# Altium project B100.PrjPcb (part 1 of 7)
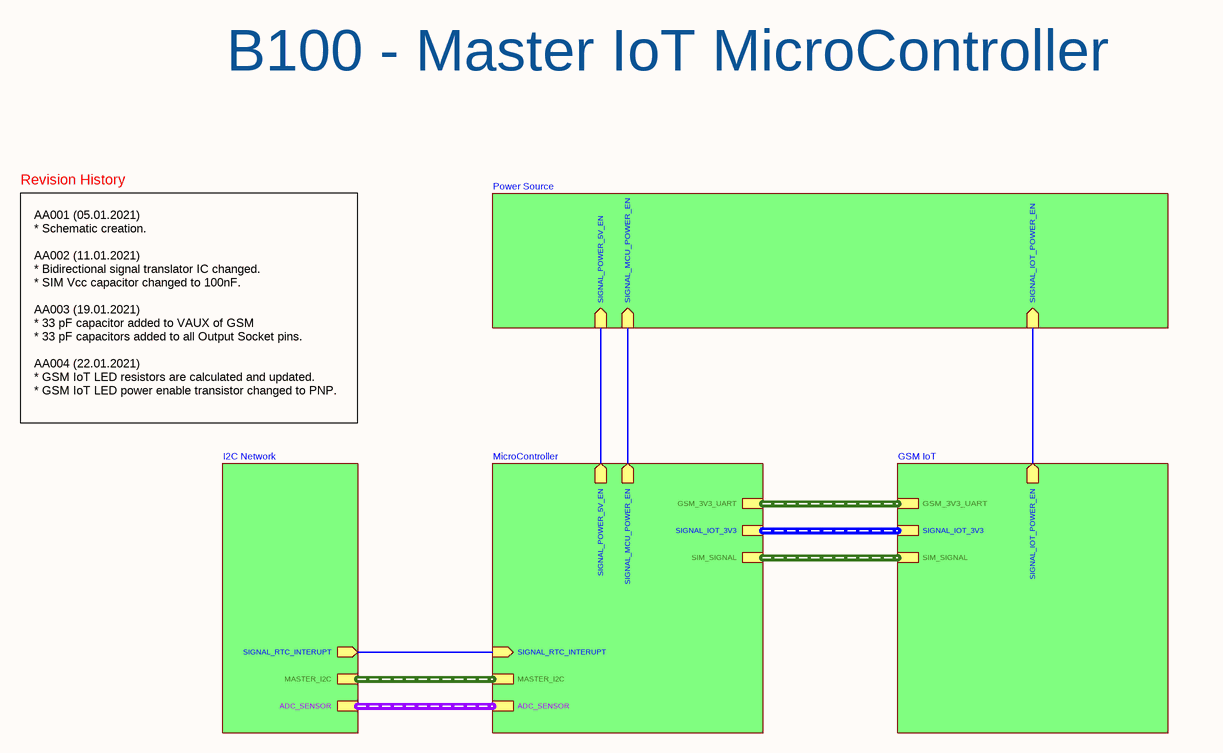
[diagram p0: B100 Block Diagram.SchDoc]
Address1_: Necip Fazıl Mah. Ortaırmak Sok.; Address2_: Birgül Apt. No: 19/6; Address3_: Meram / Konya; Address4_: Turkiye; Customer_: -; Engineer_: Mehmet Günce Akkoyun; Git_Repo_Address_: https://www.github.com/akkoyun/B100; link_: http://www.ovoo.me; Module_ID_: B100; Organization_: Ovoo Electronics; Phone_: +90 506 7444300; Product_Desc_: GSM Iot Based Plug&Play SOM; Product_ID_: -; Revision_: R06; Title_: Power Source Segment Block Diagram; Version_: AA
54 sheets, 361 parts. Net scope: hierarchical (ports join the sheet entries above them; power ports are global).
Board file: B100AA PCB R1.PcbDoc
Sheets:
  B100 Block Diagram.SchDoc
    Power Source = Power Source.SchDoc
      3V8 Buck Boost Converter = 3V8 Buck Boost Converter.SchDoc
      5V Buck Boost Converter = 5V Buck Boost Converter.SchDoc
      GSM Power Switch & Filter = GSM Power.SchDoc
      Main Power Switch = Main Power Switch.SchDoc
      3V3 LDO Regulator = 3V3 LDO Regulator.SchDoc
    GSM IoT = GSM IoT.SchDoc
      GE910QUAD Modem = GE910QUAD Modem.SchDoc
      Signal Control = GSM Signal Control.SchDoc
      Voltage Translator = Bidirectional Voltage Translator.SchDoc
      LED Indicators = GSM LED Indicators.SchDoc
    MicroController = MicroController.SchDoc
      Master MicroController = Master MicroController.SchDoc
        Master MicroController Core = Master MicroController Core.SchDoc
        PORT A = Master MicroController Port A.SchDoc
        PORT B = Master MicroController Port B.SchDoc
        PORT C = Master MicroController Port C.SchDoc
        PORT E = Master MicroController Port E.SchDoc
        PORT F = Master MicroController Port F.SchDoc
        PORT G = Master MicroController Port G.SchDoc
        PORT H = Master MicroController Port H.SchDoc
        PORT K = Master MicroController Port K.SchDoc
        PORT L = Master MicroController Port L.SchDoc
        PORT J = Master MicroController Port J.SchDoc
        PORT D = Master MicroController Port D.SchDoc
        Serial Communication = Master MicroController Serial Communication Port.SchDoc
      PORT Outputs = Module Output Sockets.SchDoc
        PORT K Filter Capacitors = Filter Capacitors - Port K.SchDoc
        Master ICSP Filter Capacitors = Filter Capacitors - Master ICSP.SchDoc
        PORT C Filter Capacitors = Filter Capacitors - Port C.SchDoc
        PORT L Filter Capacitors = Filter Capacitors - Port L.SchDoc
        FOTA ICSP Filter Capacitors = Filter Capacitors - FOTA ICSP.SchDoc
        SIM Signal Filter Capacitors = Filter Capacitors - External SIM.SchDoc
        Signal IoT Filter Capacitors = Filter Capacitors - Signal IoT.SchDoc
        PORT A Filter Capacitors = Filter Capacitors - Port A.SchDoc
        FOTA Digital ICSP Filter Capacitors = Filter Capacitors - FOTA Digital ICSP.SchDoc
        IoT UART Filter Capacitors = Filter Capacitors - IoT UART.SchDoc
        PORT F Filter Capacitors = Filter Capacitors - Port F.SchDoc
        Serial Communication Filter Capacitors = Filter Capacitors - Serial Communication.SchDoc
        ADC Sensor Filter Capacitors = Filter Capacitors - ADC Sensor.SchDoc
        I2C Filter Capacitors = Filter Capacitors - I2C.SchDoc
      FOTA MicroController Power Trigger = FOTA MicroController Power Switch.SchDoc
      SD Card and Select Switch = SD Card.SchDoc
      FOTA Burn Buffer = ICSP Burn Buffer.SchDoc
      FOTA MicroController = FOTA MicroController.SchDoc
      Buzzer = Buzzer.SchDoc
      LED Inducators = Master MicroController LED.SchDoc
    I2C Network = I2C Network.SchDoc
      I2C Multiplexer = I2C Multiplexer.SchDoc
      I2C Real Time Clock = Real Time Clock.SchDoc
      I2C Serial ID EEprom = Serial ID EEPROM.SchDoc
      I2C EEprom = EEPROM.SchDoc
      I2C Analog Digital Converter = Analog Digital Converter.SchDoc

## Sheet B100 Block Diagram.SchDoc: B100 Block Diagram
size A4; ApprovedBy: Mehmet Günce Akkoyun; CheckedBy: Mehmet Günce Akkoyun; Author: Mehmet Günce Akkoyun; CompanyName: Ovoo Electronics; DrawnBy: Mehmet Günce Akkoyun; Engineer: Mehmet Günce Akkoyun; Organization: Ovoo Electronics; Address1: Necip Fazıl Mah. Ortaırmak Sok.; Address2: Birgül Apt. No: 19/6; Address3: Meram / Konya; Address4: Turkiye; DocumentNumber: 1; Revision: R06; SheetNumber: 1; SheetTotal: 54

### Sub-sheets
GSM IoT = GSM IoT.SchDoc: GSM_3V3_UART (harness GSM_3V3_UART), SIGNAL_IOT_3V3 (harness SIGNAL_IOT_3V3), SIGNAL_IOT_POWER_EN (out), SIM_SIGNAL (harness SIM_SIGNAL)
I2C Network = I2C Network.SchDoc: MASTER_I2C (harness MASTER_I2C), SIGNAL_RTC_INTERUPT (out), ADC_SENSOR (harness ADC_SENSOR)
MicroController = MicroController.SchDoc: GSM_3V3_UART (harness GSM_3V3_UART), SIGNAL_IOT_3V3 (harness SIGNAL_IOT_3V3), SIM_SIGNAL (harness SIM_SIGNAL), SIGNAL_MCU_POWER_EN (out), SIGNAL_POWER_5V_EN (out), MASTER_I2C (harness MASTER_I2C), SIGNAL_RTC_INTERUPT (in), ADC_SENSOR (harness ADC_SENSOR)
Power Source = Power Source.SchDoc: SIGNAL_MCU_POWER_EN (in), SIGNAL_IOT_POWER_EN (in), SIGNAL_POWER_5V_EN (in)

### Nets
SIGNAL_IOT_3V3.SIGNAL_IOT_POWER_EN: sheet Power Source/SIGNAL_IOT_POWER_EN, sheet GSM IoT/SIGNAL_IOT_POWER_EN
SIGNAL_MCU_POWER_EN: sheet Power Source/SIGNAL_MCU_POWER_EN, sheet MicroController/SIGNAL_MCU_POWER_EN
SIGNAL_POWER_5V_EN: sheet Power Source/SIGNAL_POWER_5V_EN, sheet MicroController/SIGNAL_POWER_5V_EN
SIGNAL_RTC_INTERUPT: sheet MicroController/SIGNAL_RTC_INTERUPT, sheet I2C Network/SIGNAL_RTC_INTERUPT

### Buses and harness runs
harness sheet GSM IoT/GSM_3V3_UART = sheet MicroController/GSM_3V3_UART
harness sheet GSM IoT/SIGNAL_IOT_3V3 = sheet MicroController/SIGNAL_IOT_3V3
harness sheet GSM IoT/SIM_SIGNAL = sheet MicroController/SIM_SIGNAL
harness sheet I2C Network/ADC_SENSOR = sheet MicroController/ADC_SENSOR
harness sheet I2C Network/MASTER_I2C = sheet MicroController/MASTER_I2C

### Notes on the sheet
- B100 - Master IoT MicroController
- Revision History
- AA001 (05.01.2021)
  * Schematic creation.
  AA002 (11.01.2021)
  * Bidirectional signal translator IC changed.
  * SIM Vcc capacitor changed to 100nF.
  AA003 (19.01.2021)
  * 33 pF capacitor added to VAUX of GSM
  * 33 pF capacitors added to all Output Socket pins.
  AA004 (22.01.2021)
  * GSM IoT LED resistors are calculated and updated.
  * GSM IoT LED power enable transistor changed to PNP.
- Engineer
- All Rights are reserved to Customer and Engineer. [2021]
- Size:
- Date:
- A4
- Project :
- Time:
- Sheet
- of
- Customer
- Product ID
- Module ID
- Version
- File:
- Revision

## Sheet Power Source.SchDoc: Power Architechture Block Diagram
size A3; ApprovedBy: Mehmet Günce Akkoyun; CheckedBy: Mehmet Günce Akkoyun; Author: Mehmet Günce Akkoyun; CompanyName: Ovoo Electronics; DrawnBy: Mehmet Günce Akkoyun; Engineer: Mehmet Günce Akkoyun; Organization: Ovoo Electronics; Address1: Necip Fazıl Mah. Ortaırmak Sok.; Address2: Birgül Apt. No: 19/6; Address3: Meram / Konya; Address4: Turkiye; DocumentNumber: 2; Revision: R06; SheetNumber: 2; SheetTotal: 54
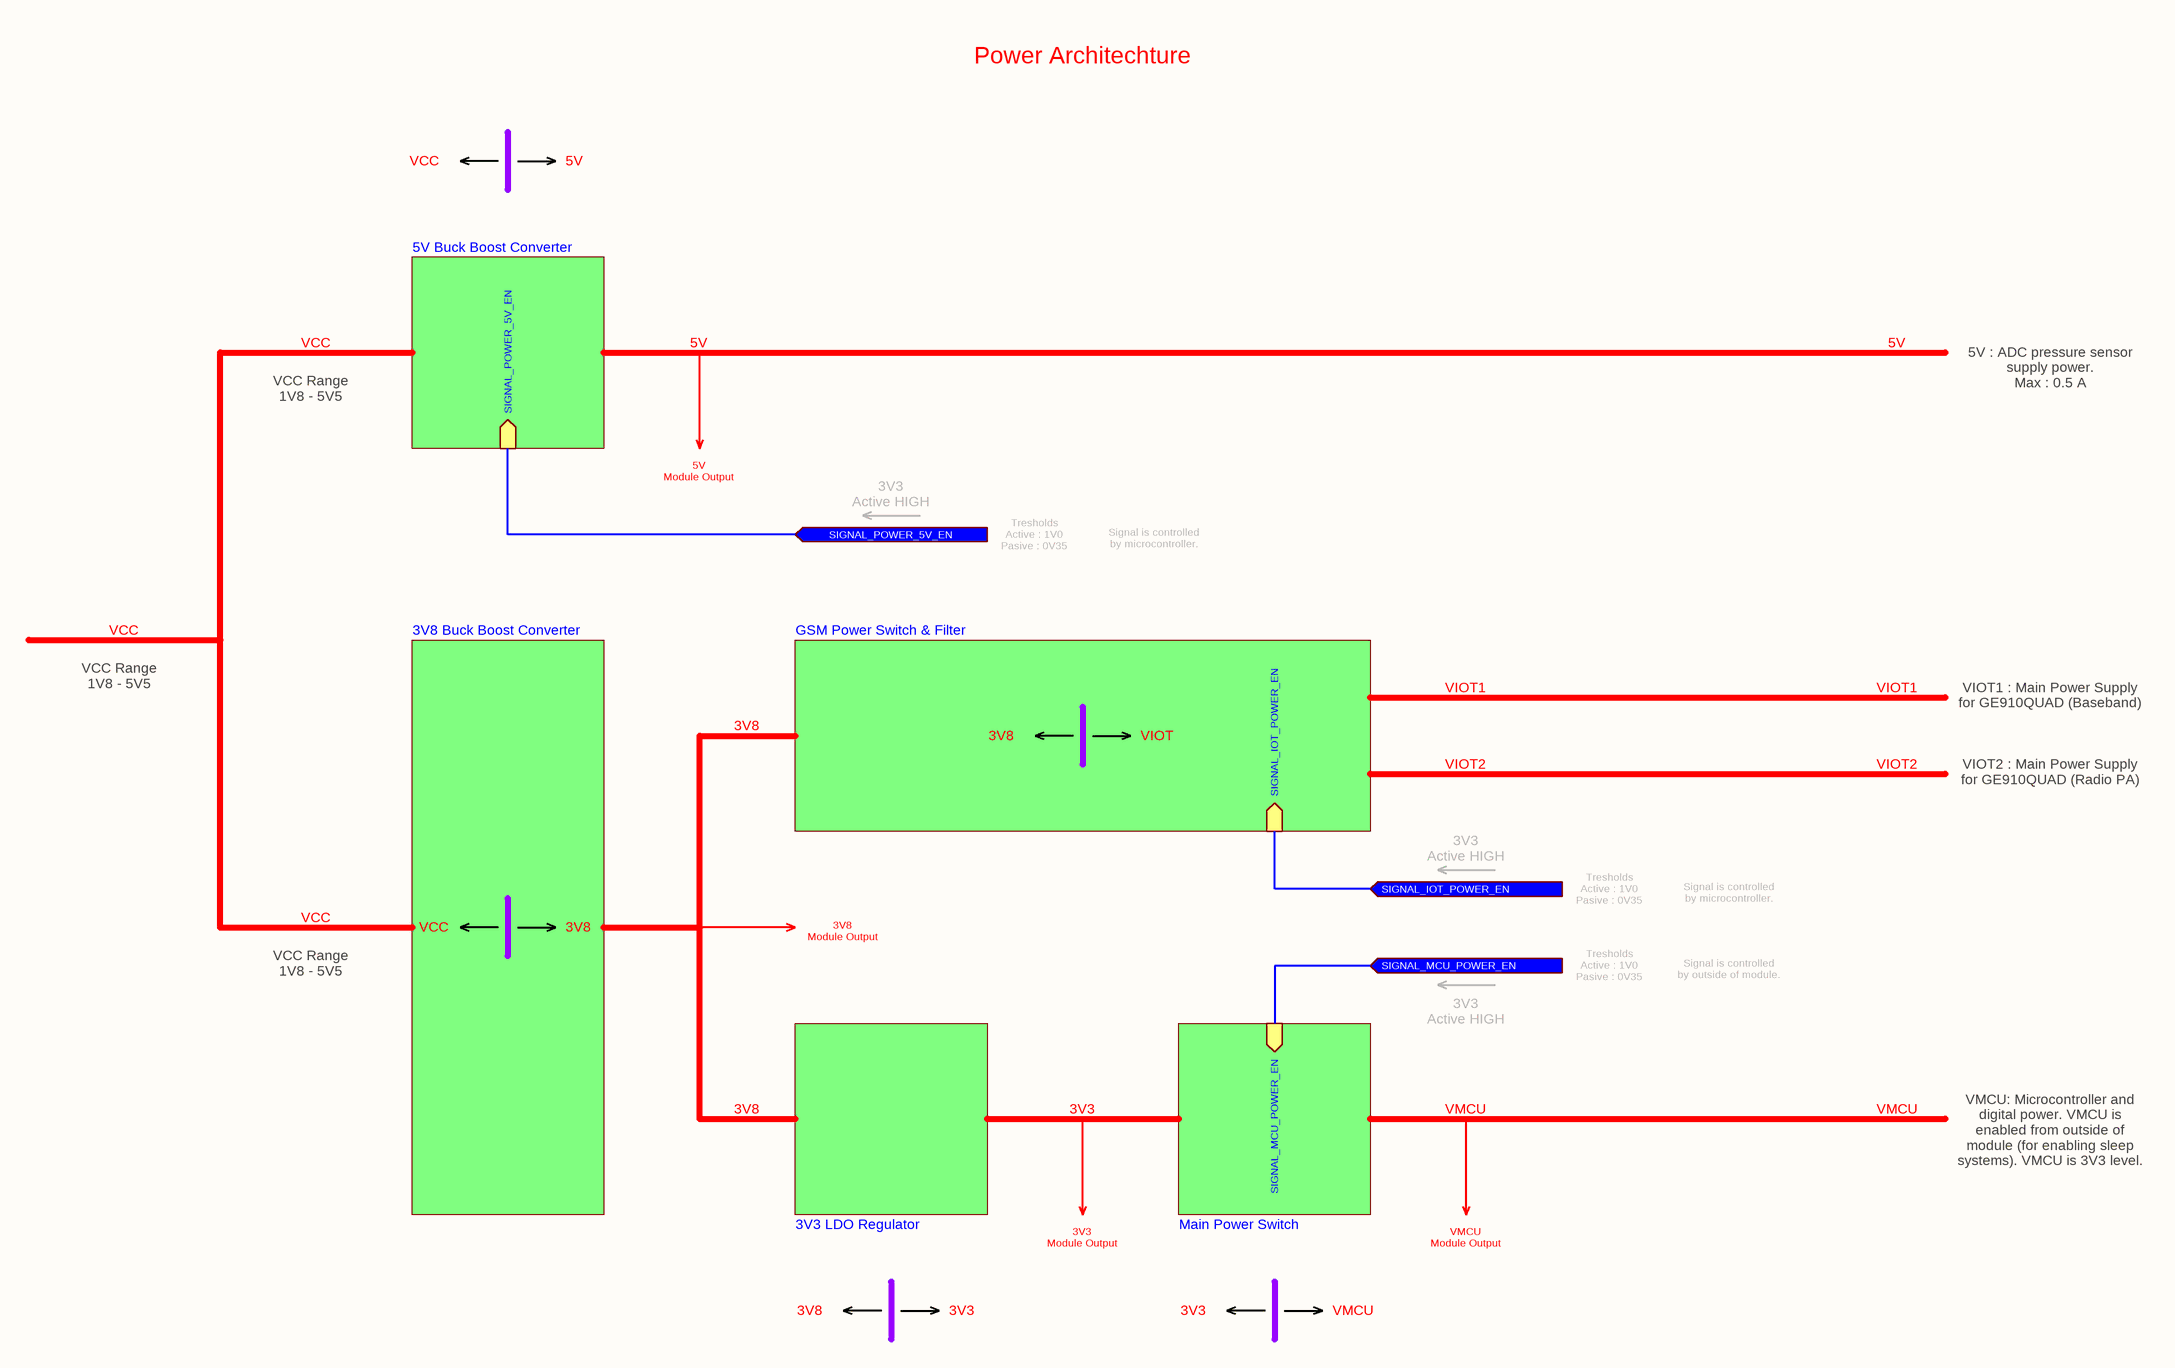
[diagram p1: Power Source.SchDoc]

### Sub-sheets
3V3 LDO Regulator = 3V3 LDO Regulator.SchDoc: no entries
3V8 Buck Boost Converter = 3V8 Buck Boost Converter.SchDoc: no entries
5V Buck Boost Converter = 5V Buck Boost Converter.SchDoc: SIGNAL_POWER_5V_EN (in)
GSM Power Switch & Filter = GSM Power.SchDoc: SIGNAL_IOT_POWER_EN (in)
Main Power Switch = Main Power Switch.SchDoc: SIGNAL_MCU_POWER_EN (in)

### Ports
SIGNAL_IOT_POWER_EN (in), SIGNAL_MCU_POWER_EN (in), SIGNAL_POWER_5V_EN (in)

### Nets
SIGNAL_IOT_3V3.SIGNAL_IOT_POWER_EN: port SIGNAL_IOT_POWER_EN, sheet GSM Power Switch & Filter/SIGNAL_IOT_POWER_EN
SIGNAL_MCU_POWER_EN: port SIGNAL_MCU_POWER_EN, sheet Main Power Switch/SIGNAL_MCU_POWER_EN
SIGNAL_POWER_5V_EN: port SIGNAL_POWER_5V_EN, sheet 5V Buck Boost Converter/SIGNAL_POWER_5V_EN

### Notes on the sheet
- Power Architechture
- VCC
- 5V
- VCC Range
  1V8 - 5V5
- 5V
  Module Output
- 5V : ADC pressure sensor supply power.
  Max : 0.5 A
- 3V3
  Active HIGH
- Tresholds
  Active : 1V0
  Pasive : 0V35
- Signal is controlled by microcontroller.
- 3V8
- VIOT
- VIOT2
- VIOT1
- VIOT1 : Main Power Supply for GE910QUAD (Baseband)
- VIOT2 : Main Power Supply for GE910QUAD (Radio PA)
- 3V8
  Module Output
- Signal is controlled by outside of module.
- 3V3
- VMCU
- 3V3
  Module Output
- VMCU
  Module Output
- VMCU: Microcontroller and digital power. VMCU is enabled from outside of module (for enabling sleep systems). VMCU is 3V3 level.
- Title
- Size:
- Date:
- A3
- Number:
- Time:
- Revision:
- Sheet
- of
- File:

## Sheet 3V8 Buck Boost Converter.SchDoc: 3V8 DC/DC Buck Boost Converter
size A4; ApprovedBy: Mehmet Günce Akkoyun; CheckedBy: Mehmet Günce Akkoyun; Author: Mehmet Günce Akkoyun; CompanyName: Ovoo Electronics; DrawnBy: Mehmet Günce Akkoyun; Engineer: Mehmet Günce Akkoyun; Organization: Ovoo Electronics; Address1: Necip Fazıl Mah. Ortaırmak Sok.; Address2: Birgül Apt. No: 19/6; Address3: Meram / Konya; Address4: Turkiye; DocumentNumber: 3; Revision: R06; SheetNumber: 3; SheetTotal: 54
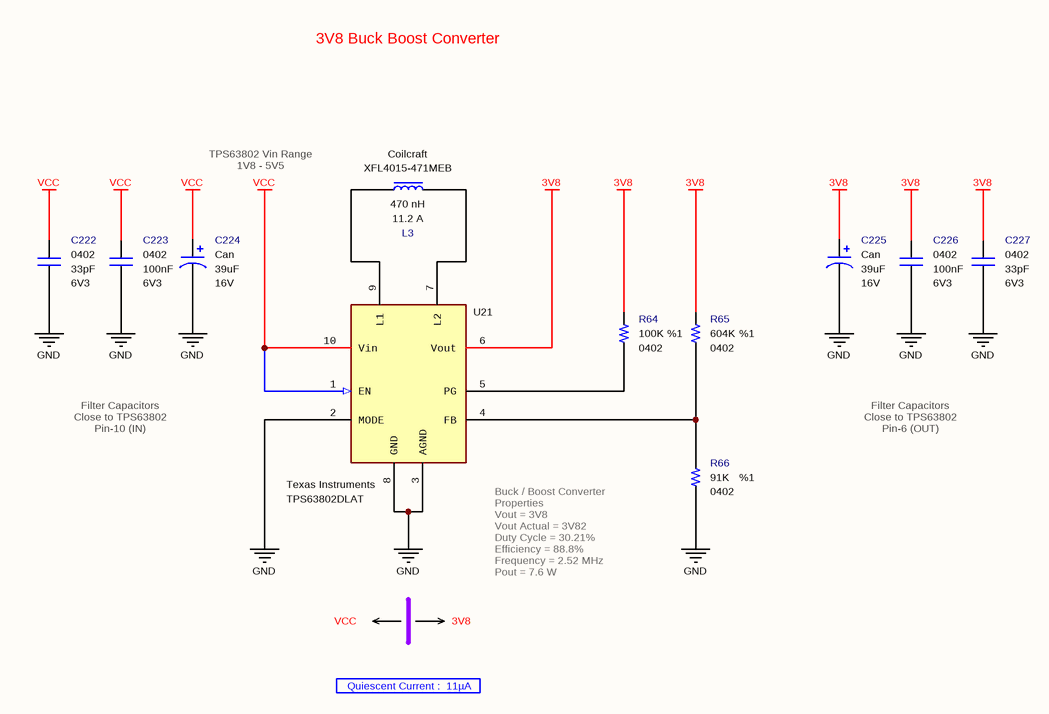
[diagram p2: 3V8 Buck Boost Converter.SchDoc]

### Parts
C222  value 33pF  Case: 0402  Voltage: 6V3  [CAPACITOR_0402]  (hidden comment: Multilayer Ceramic Capacitor)
C223  value 100nF  Case: 0402  Voltage: 6V3  [CAPACITOR_0402]  (hidden comment: Multilayer Ceramic Capacitor)
C224  value 39uF  Case: Can  Voltage: 16V  [CAPACITOR_CAN-B6]  (hidden comment: Aluminium Organic Polymer Capacitors)
C225  value 39uF  Case: Can  Voltage: 16V  [CAPACITOR_CAN-B6]  (hidden comment: Aluminium Organic Polymer Capacitors)
C226  value 100nF  Case: 0402  Voltage: 6V3  [CAPACITOR_0402]  (hidden comment: Multilayer Ceramic Capacitor)
C227  value 33pF  Case: 0402  Voltage: 6V3  [CAPACITOR_0402]  (hidden comment: Multilayer Ceramic Capacitor)
L3  value 470 nH  Maximum DC Current: 11.2 A  Manufacturer Part Number: XFL4015-471MEB  Manufacturer Name: Coilcraft  [INDUCTOR_XFL4015]  (hidden comment: Fixed Inductor)
R64  value 100K  Tolerance: %1  Case: 0402  [RESISTOR_0402]  (hidden comment: Thick Film Resistor)
R65  value 604K  Tolerance: %1  Case: 0402  [RESISTOR_0402]  (hidden comment: Thick Film Resistor)
R66  value 91K  Tolerance: %1  Case: 0402  [RESISTOR_0402]  (hidden comment: Thick Film Resistor)
U21  Manufacturer Part Number: TPS63802DLAT  Manufacturer Name: Texas Instruments  [VSON-10]  (hidden comment: Buck-Boost Converter)

### Nets
3V8: C225.1 C226.1 C227.2 R64.2 R65.2 U21.6(Vout)
GND: C222.1 C223.2 C224.2 C225.2 C226.2 C227.1 R66.1 U21.2(MODE) U21.3(AGND) U21.8(GND)
VCC: C222.2 C223.1 C224.1 U21.1(EN) U21.10(Vin)
NetL3_1: L3.1 U21.9(L1)
NetL3_2: L3.2 U21.7(L2)
NetR64_1: R64.1 U21.5(PG)
NetR65_1: R65.1 R66.2 U21.4(FB)

### Notes on the sheet
- 3V8 Buck Boost Converter
- TPS63802 Vin Range
  1V8 - 5V5
- Filter Capacitors
  Close to TPS63802
  Pin-10 (IN)
- Filter Capacitors
  Close to TPS63802
  Pin-6 (OUT)
- VCC
- 3V8
- Buck / Boost Converter Properties
  Vout = 3V8
  Vout Actual = 3V82
  Duty Cycle = 30.21%
  Efficiency = 88.8%
  Frequency = 2.52 MHz
  Pout = 7.6 W
- Quiescent Current :  11µA
- Engineer
- All Rights are reserved to Customer and Engineer. [2021]
- Size:
- Date:
- A4
- Project :
- Time:
- Sheet
- of
- Customer
- Product ID
- Module ID
- Version
- File:
- Revision

### Library data of the parts
C222 C227 = Capacitor - 33pF [0402-6V3]: Capacitor - 33pF [0402] (Ceramic); Manufacturer Name: Kemet; Manufacturer Part Number: C0402C330J9RACAUTO; Dielectric: X7R; Tolerance: 10%; Height: 0.5mm; Mouser Part Number: 80-C0402C330J9RAUTO; Maximum Operating Temperature: +125; Minimum Operating Temperature: -55; ROHS: Yes; ComponentLink1Description: DataSheet; ComponentLink1URL: https://api.kemet.com/component-edge/download/datasheet/C0402C330J9RACAUTO.pdf; ComponentLink2Description: Mouser; ComponentLink2URL: https://www.mouser.com/Search/Refine.aspx?Keyword=80-C0402C330J9RAUTO; Supplier 1: Mouser; Supplier Part Number 1: 80-C0402C330J9RAUTO
C223 C226 = Capacitor - 100nF [0402-6V3]: Capacitor - 100nF [0402-6V3] (Ceramic); Manufacturer Name: AVX; Manufacturer Part Number: 04026D104KAT4A; Dielectric: X5R; Tolerance: %10; Height: 0.25mm; ComponentLink1Description: Mouser; ComponentLink1URL: https://www.mouser.com.tr/ProductDetail/AVX/04026D104KAT4A?qs=sGAEpiMZZMs0AnBnWHyRQPg4iYkCw7IMED%2F4kpqgf7w%3D; ComponentLink2Description: DataSheet; ComponentLink2URL: https://www.mouser.com.tr/datasheet/2/40/cx5r-776519.pdf; ROHS: Yes; Maximum Operating Temperature: +85; Minimum Operating Temperature: -55; Supplier 1: Avnet; Supplier Part Number 1: 04026D104KAT4A; Mouser Part Number: 581-04026D104KAT4A
C224 C225 = Capacitor - 39uF [Can-16V]: Capacitor - 39uF 16V [Can] (Electrolytic); Manufacturer Name: Panasonic; Manufacturer Part Number: 16SVPC39MV; Leakage Current: 300uA; Tolerance: 20%; ESR: 27 mOhms; Height: 6mm; Maximum Operating Temperature: +105; Minimum Operating Temperature: -55; ROHS: Yes; ComponentLink1Description: DataSheet; ComponentLink1URL: https://www.mouser.com.tr/datasheet/2/315/SVPC_OS-1197065.pdf; ComponentLink2Description: Mouser; ComponentLink2URL: https://www.mouser.com.tr/ProductDetail/Panasonic/16SVPC39MV?qs=%2Fha2pyFadujpu3ATUg5hwJ6EWbTfmGGWJDu5kzoHUqwaZzNIr7t5GA%3D%3D; Supplier 1: Mouser; Supplier 2: Digi-Key; Supplier Part Number 2: P16473CT-ND; Supplier Part Number 1: 667-16SVPC39MV; Mouser Part Number: 667-16SVPC39MV
L3 = Inductor - 470 nH [SMD]: Fixed Inductors 0.47uH 20% 11.2A 8.36mOhms AEC-Q200; Height: 1.6mm; ComponentLink1Description: DataSheet; ComponentLink1URL: https://eu.mouser.com/datasheet/2/597/xfl4015-270755.pdf; ComponentLink2Description: Mouser; ComponentLink2URL: https://eu.mouser.com/ProductDetail/Coilcraft/XFL4015-471MEB?qs=VJjuEbE9QBO6UaDdUAgr%252Bw%3D%3D; Maximum DC Resistance: 8.36 mOhms; Maximum Operating Temperature: +125; Minimum Operating Temperature: -40; Tolerance: 20%; Supplier 1: Mouser; Supplier 2: Farnell; Supplier 3: Digi-Key; Supplier 4: Newark; Supplier Part Number 1: 710-7443551130; Supplier Part Number 2: 1869775; Supplier Part Number 4: 32T8562; Supplier Part Number 3: 732-1124-1-ND; Case: XFL4015; Mouser Part Number: 994-XFL4015-471MEB
R64 = Resistor - 100K: Thick Film Resistors - SMD 1/16 W 100 Kohms 1%; Manufacturer Name: Vishay; Manufacturer Part Number: CRCW0402100KFKED; Height: 0.35mm; ComponentLink1Description: DataSheet; ComponentLink1URL: https://www.mouser.com.tr/datasheet/2/427/dcrcwe3-1762152.pdf; ComponentLink2Description: Mouser; ComponentLink2URL: https://eu.mouser.com/ProductDetail/Vishay-Dale/CRCW0402100KFKED?qs=OlqPY1CiralZGKRwQ4Glcg%3D%3D; Supplier 1: Future Electronics; Supplier 2: Future Electronics; Supplier 3: Arrow; Supplier 4: Farnell; Supplier 5: Digi-Key; Supplier Part Number 1: CRCW0402100KFKED-CUTT; Supplier Part Number 2: CRCW0402100KFKED-REEL; Supplier Part Number 3: CRCW0402100KFKED; Supplier Part Number 4: 2121857; Supplier Part Number 5: 541-100KLCT-ND; Mouser Part Number: 71-CRCW0402-100K-E3
R65 = Resistor - 604K: Thick Film Resistors - SMD 1/16 W 604 Kohms 1%; Manufacturer Name: Vishay; Manufacturer Part Number: CRCW0402604KFKED; Height: 0.35mm; ComponentLink1Description: DataSheet; ComponentLink1URL: https://eu.mouser.com/datasheet/2/427/dcrcwe3-1762152.pdf; ComponentLink2Description: Mouser; ComponentLink2URL: https://eu.mouser.com/ProductDetail/Vishay-Dale/CRCW0402604KFKED?qs=DKbL89i6OEpzv5ZGRZfINw%3D%3D; Supplier 1: Mouser; Supplier 2: Digi-Key; Supplier Part Number 1: 71-CRCW0402390KFKED; Supplier Part Number 2: 541-390KLCT-ND; Mouser Part Number: 71-CRCW0402-604K-E3
R66 = Resistor - 91K: Thick Film Resistors - SMD 1/16 W 91 Kohms 1%; Manufacturer Name: Vishay; Manufacturer Part Number: CRCW040291K0FKED; Height: 0.35mm; ComponentLink1Description: DataSheet; ComponentLink1URL: https://eu.mouser.com/datasheet/2/427/dcrcwe3-1762152.pdf; ComponentLink2Description: Mouser; ComponentLink2URL: https://eu.mouser.com/ProductDetail/Vishay-Dale/CRCW040291K0FKED?qs=Po1ctqG%2F82oNfd9H7rZeFQ%3D%3D; Supplier 1: Future Electronics; Supplier 2: Arrow; Supplier 3: Farnell; Supplier 4: Newark; Supplier 5: Digi-Key; Supplier Part Number 1: CRCW040291K0FKED-REEL; Supplier Part Number 2: CRCW040291K0FKED; Supplier Part Number 3: 2121853; Supplier Part Number 4: 24W2519; Supplier Part Number 5: 541-91.0KLCT-ND; Mouser Part Number: 71-CRCW040291K0FKED
U21 = IC - TPS63802DLAT: Switching Voltage Regulators High current, high efficiency single inductor buck-boost converter 10-VSON-HR -40 to 125; ComponentLink1Description: DataSheet; ComponentLink1URL: https://www.ti.com/lit/ds/symlink/tps63802.pdf?ts=1611132560608&ref_url=https%253A%252F%252Fwww.google.com%252F; ComponentLink2Description: Mouser; ComponentLink2URL: https://www.mouser.com.tr/ProductDetail/Maxim-Integrated/MAX17055ETB%2bT?qs=sGAEpiMZZMve4%2FbfQkoj%252BAs6FTSsQJaJrD7Z3v0Qe9M%3D; Minimum Operating Temperature: -40; Maximum Operating Temperature: +125; Supplier 1: Avnet; Supplier 2: Mouser; Supplier 3: Digi-Key; Supplier Part Number 1: TPS63802DLAT; Supplier Part Number 2: 595-TPS63802DLAT; Supplier Part Number 3: 296-TPS63802DLATCT-ND; Case: VSON-10; ComponentLink3Description: Product Page; ComponentLink3URL: https://www.ti.com/store/ti/en/p/product/?p=TPS63802DLAT; Mouser Part Number: 595-TPS63802DLAT

## Sheet 5V Buck Boost Converter.SchDoc: 5V DC/DC Buck Boost Converter
size A4; ApprovedBy: Mehmet Günce Akkoyun; CheckedBy: Mehmet Günce Akkoyun; Author: Mehmet Günce Akkoyun; CompanyName: Ovoo Electronics; DrawnBy: Mehmet Günce Akkoyun; Engineer: Mehmet Günce Akkoyun; Organization: Ovoo Electronics; Address1: Necip Fazıl Mah. Ortaırmak Sok.; Address2: Birgül Apt. No: 19/6; Address3: Meram / Konya; Address4: Turkiye; DocumentNumber: 7; Revision: R06; SheetNumber: 7; SheetTotal: 54
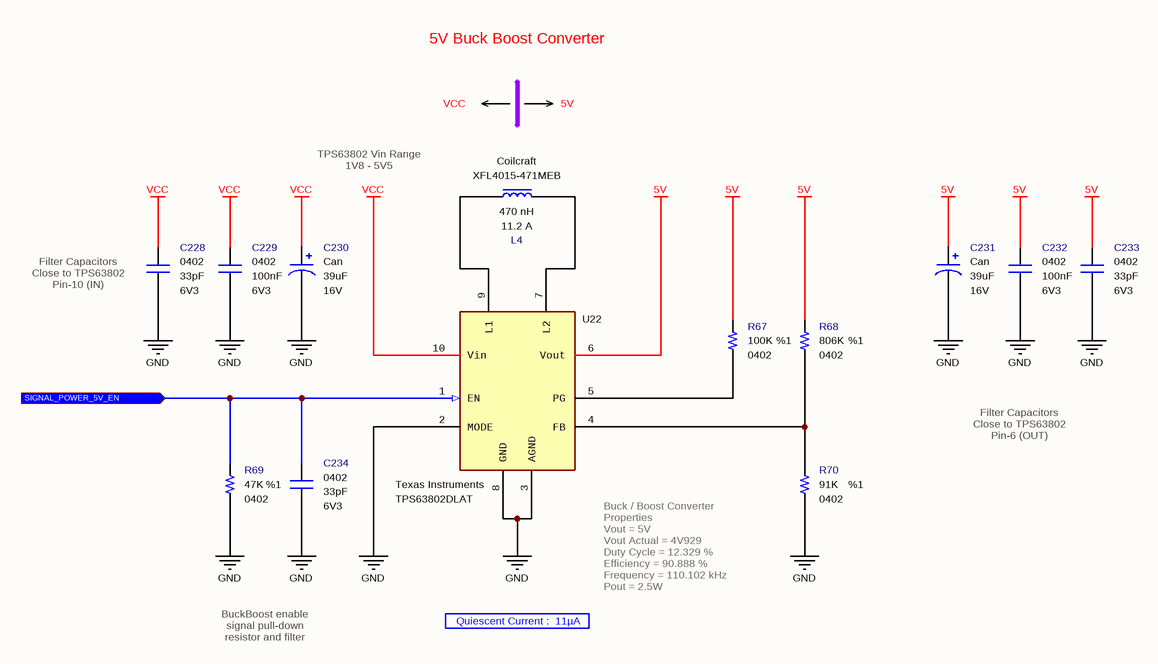
[diagram p3: 5V Buck Boost Converter.SchDoc]

### Parts
C228  value 33pF  Case: 0402  Voltage: 6V3  [CAPACITOR_0402]  (hidden comment: Multilayer Ceramic Capacitor)
C229  value 100nF  Case: 0402  Voltage: 6V3  [CAPACITOR_0402]  (hidden comment: Multilayer Ceramic Capacitor)
C230  value 39uF  Case: Can  Voltage: 16V  [CAPACITOR_CAN-B6]  (hidden comment: Aluminium Organic Polymer Capacitors)
C231  value 39uF  Case: Can  Voltage: 16V  [CAPACITOR_CAN-B6]  (hidden comment: Aluminium Organic Polymer Capacitors)
C232  value 100nF  Case: 0402  Voltage: 6V3  [CAPACITOR_0402]  (hidden comment: Multilayer Ceramic Capacitor)
C233  value 33pF  Case: 0402  Voltage: 6V3  [CAPACITOR_0402]  (hidden comment: Multilayer Ceramic Capacitor)
C234  value 33pF  Case: 0402  Voltage: 6V3  [CAPACITOR_0402]  (hidden comment: Multilayer Ceramic Capacitor)
L4  value 470 nH  Maximum DC Current: 11.2 A  Manufacturer Part Number: XFL4015-471MEB  Manufacturer Name: Coilcraft  [INDUCTOR_XFL4015]  (hidden comment: Fixed Inductor)
R67  value 100K  Tolerance: %1  Case: 0402  [RESISTOR_0402]  (hidden comment: Thick Film Resistor)
R68  value 806K  Tolerance: %1  Case: 0402  [RESISTOR_0402]  (hidden comment: Thick Film Resistor)
R69  value 47K  Tolerance: %1  Case: 0402  [RESISTOR_0402]  (hidden comment: 47K - 0402 - %1 - 1/16W)
R70  value 91K  Tolerance: %1  Case: 0402  [RESISTOR_0402]  (hidden comment: Thick Film Resistor)
U22  Manufacturer Part Number: TPS63802DLAT  Manufacturer Name: Texas Instruments  [VSON-10]  (hidden comment: Buck-Boost Converter)

### Ports
SIGNAL_POWER_5V_EN (in)

### Nets
5V: C231.1 C232.1 C233.2 R67.2 R68.2 U22.6(Vout)
GND: C228.1 C229.2 C230.2 C231.2 C232.2 C233.1 C234.1 R69.1 R70.1 U22.2(MODE) U22.3(AGND) U22.8(GND)
VCC: C228.2 C229.1 C230.1 U22.10(Vin)
SIGNAL_POWER_5V_EN: C234.2 R69.2 U22.1(EN) ; port SIGNAL_POWER_5V_EN
NetL4_1: L4.1 U22.9(L1)
NetL4_2: L4.2 U22.7(L2)
NetR67_1: R67.1 U22.5(PG)
NetR68_1: R68.1 R70.2 U22.4(FB)

### Notes on the sheet
- 5V Buck Boost Converter
- VCC
- 5V
- TPS63802 Vin Range
  1V8 - 5V5
- (near C228) Filter Capacitors
  Close to TPS63802
  Pin-10 (IN)
- Filter Capacitors
  Close to TPS63802
  Pin-6 (OUT)
- BuckBoost enable signal pull-down resistor and filter capacitor.
- Quiescent Current :  11µA
- Buck / Boost Converter Properties
  Vout = 5V
  Vout Actual = 4V929
  Duty Cycle = 12.329 %
  Efficiency = 90.888 %
  Frequency = 110.102 kHz
  Pout = 2.5W
- Engineer
- All Rights are reserved to Customer and Engineer. [2021]
- Size:
- Date:
- A4
- Project :
- Time:
- Sheet
- of
- Customer
- Product ID
- Module ID
- Version
- File:
- Revision

### Library data of the parts
C228 C233 C234 = Capacitor - 33pF [0402-6V3]: as C222 on sheet 3V8 Buck Boost Converter; Height: 0.5mm; Maximum Operating Temperature: +125; Minimum Operating Temperature: -55; ROHS: Yes; ComponentLink1Description: DataSheet; ComponentLink1URL: https://api.kemet.com/component-edge/download/datasheet/C0402C330J9RACAUTO.pdf; ComponentLink2Description: Mouser; ComponentLink2URL: https://www.mouser.com/Search/Refine.aspx?Keyword=80-C0402C330J9RAUTO; Supplier 1: Mouser; Supplier Part Number 1: 80-C0402C330J9RAUTO; Mouser Part Number: 80-C0402C330J9RAUTO
C229 C232 = Capacitor - 100nF [0402-6V3]: as C223 on sheet 3V8 Buck Boost Converter; Height: 0.25mm; ComponentLink1Description: Mouser; ComponentLink1URL: https://www.mouser.com.tr/ProductDetail/AVX/04026D104KAT4A?qs=sGAEpiMZZMs0AnBnWHyRQPg4iYkCw7IMED%2F4kpqgf7w%3D; ComponentLink2Description: DataSheet; ComponentLink2URL: https://www.mouser.com.tr/datasheet/2/40/cx5r-776519.pdf; ROHS: Yes; Maximum Operating Temperature: +85; Minimum Operating Temperature: -55; Supplier 1: Avnet; Supplier Part Number 1: 04026D104KAT4A; Mouser Part Number: 581-04026D104KAT4A
C230 C231 = Capacitor - 39uF [Can-16V]: as C224 on sheet 3V8 Buck Boost Converter; Height: 6mm; Maximum Operating Temperature: +105; Minimum Operating Temperature: -55; ROHS: Yes; ComponentLink1Description: DataSheet; ComponentLink1URL: https://www.mouser.com.tr/datasheet/2/315/SVPC_OS-1197065.pdf; ComponentLink2Description: Mouser; ComponentLink2URL: https://www.mouser.com.tr/ProductDetail/Panasonic/16SVPC39MV?qs=%2Fha2pyFadujpu3ATUg5hwJ6EWbTfmGGWJDu5kzoHUqwaZzNIr7t5GA%3D%3D; Supplier 1: Mouser; Supplier 2: Digi-Key; Supplier Part Number 2: P16473CT-ND; Supplier Part Number 1: 667-16SVPC39MV; Mouser Part Number: 667-16SVPC39MV
L4 = Inductor - 470 nH [SMD]: as L3 on sheet 3V8 Buck Boost Converter; Height: 1.6mm; ComponentLink1Description: DataSheet; ComponentLink1URL: https://eu.mouser.com/datasheet/2/597/xfl4015-270755.pdf; ComponentLink2Description: Mouser; ComponentLink2URL: https://eu.mouser.com/ProductDetail/Coilcraft/XFL4015-471MEB?qs=VJjuEbE9QBO6UaDdUAgr%252Bw%3D%3D; Maximum DC Resistance: 8.36 mOhms; Maximum Operating Temperature: +125; Minimum Operating Temperature: -40; Tolerance: 20%; Supplier 1: Mouser; Supplier 2: Farnell; Supplier 3: Farnell; Supplier Part Number 1: 994-XFL4015-471MEB; Supplier Part Number 2: 2289211; Supplier Part Number 3: 2289211RL; Case: XFL4015
R67 = Resistor - 100K: as R64 on sheet 3V8 Buck Boost Converter; Height: 0.35mm; ComponentLink1Description: DataSheet; ComponentLink1URL: https://www.mouser.com.tr/datasheet/2/427/dcrcwe3-1762152.pdf; ComponentLink2Description: Mouser; ComponentLink2URL: https://eu.mouser.com/ProductDetail/Vishay-Dale/CRCW0402100KFKED?qs=OlqPY1CiralZGKRwQ4Glcg%3D%3D; Supplier 1: Future Electronics; Supplier 2: Future Electronics; Supplier 3: Arrow; Supplier 4: Farnell; Supplier 5: Digi-Key; Supplier Part Number 1: CRCW0402100KFKED-CUTT; Supplier Part Number 2: CRCW0402100KFKED-REEL; Supplier Part Number 3: CRCW0402100KFKED; Supplier Part Number 4: 2121857; Supplier Part Number 5: 541-100KLCT-ND; Mouser Part Number: 71-CRCW0402-100K-E3
R68 = Resistor - 806K: Thick Film Resistors - SMD 1/16 W 806 Kohms 1%; Manufacturer Name: Vishay; Manufacturer Part Number: CRCW0402806KFKED; Height: 0.35mm; ComponentLink1Description: DataSheet; ComponentLink1URL: https://www.mouser.com.tr/datasheet/2/427/dcrcwe3-1762152.pdf; ComponentLink2Description: Mouser; ComponentLink2URL: https://www.mouser.com.tr/ProductDetail/Vishay-Dale/CRCW0402806KFKED/?qs=cra7cYzOg1xpxTzRs9o4Mw%3D%3D; Supplier 1: Avnet; Supplier 2: Future Electronics; Supplier 3: Future Electronics; Supplier 4: Mouser; Supplier 5: Farnell; Supplier 6: Newark; Supplier 7: Digi-Key; Supplier 8: Digi-Key; Supplier 9: Newark; Supplier 10: Digi-Key; Supplier Part Number 1: CRCW0402806KFKED; Supplier Part Number 2: 7425135; Supplier Part Number 3: 9019379; Supplier Part Number 4: 71-CRCW0402-806K-E3; Supplier Part Number 5: 2141028; Supplier Part Number 6: 52K7299; Supplier Part Number 7: 541-806KLCT-ND; Supplier Part Number 8: 541-806KLDKR-ND; Supplier Part Number 9: 26W9212; Supplier Part Number 10: 541-806KLTR-ND; Mouser Part Number: 71-CRCW0402-806K-E3
R69 = Resistor - 47K: Thick Film Resistors - SMD 1/16 W 47 Kohms 1%; Manufacturer Name: Vishay; Manufacturer Part Number: CRCW040247K0FKED; Height: 0.4mm; ComponentLink1Description: DataSheet; ComponentLink1URL: https://www.mouser.com.tr/datasheet/2/427/dcrcwe3-1762152.pdf; ComponentLink2Description: Mouser; ComponentLink2URL: https://www.mouser.com.tr/ProductDetail/Vishay-Dale/CRCW040247K0FKED?qs=sGAEpiMZZMu61qfTUdNhG2DpbjADlD3GL%252B3h1elTxqU%3D; Supplier 1: RSComponents; Supplier 2: Newark; Supplier Part Number 1: 6789361P; Supplier Part Number 2: 52K7097; Supplier 3: Avnet; Supplier 4: RSComponents; Supplier 5: Future Electronics; Supplier 6: Future Electronics; Supplier 7: Newark; Supplier 8: Arrow Electronics; Supplier 9: Mouser; Supplier 10: Newark; Supplier 11: Avnet; Supplier 12: Digi-Key; Supplier 13: Digi-Key; Supplier 14: Digi-Key; Supplier 15: Newark; Supplier 16: Farnell; Supplier 17: Farnell; Supplier 18: Farnell; Supplier 19: Allied Electronics; Supplier 20: Allied Electronics; Supplier 21: Avnet; Supplier 22: Future Electronics; Supplier 23: Future Electronics; Supplier 24: Future Electronics; Supplier 25: Newark; Supplier 26: RSComponents; Supplier 27: RSComponents; Supplier Part Number 3: 52K7097; Supplier Part Number 4: 6789361; Supplier Part Number 5: 2103738; Supplier Part Number 6: 7521222; Supplier Part Number 7: 42K3500; Supplier Part Number 8: CRCW040247K0FKED; Supplier Part Number 12: 541-47.0KLCT-ND; Supplier Part Number 14: 541-47.0KLTR-ND; Supplier Part Number 10: 61M5310; Supplier Part Number 9: 71-CRCW0402-47K-E3; Supplier Part Number 13: 541-47.0KLDKR-ND; Supplier Part Number 11: CRCW040247K0FKED; Supplier Part Number 15: 25AC7165; Supplier Part Number 16: 1469719; Supplier Part Number 18: 2121814; Supplier Part Number 17: 1469719RL; Supplier Part Number 19: 70202660; Supplier Part Number 20: 70272767; Supplier Part Number 21: 42K3500; Supplier Part Number 22: 6128776; Supplier Part Number 24: CRCW040247K0FKED-REEL; Supplier Part Number 23: CRCW040247K0FKED-CUTT; Supplier Part Number 25: 24W2315; Supplier Part Number 26: 1688455; Supplier Part Number 27: 1823505
R70 = Resistor - 91K: as R66 on sheet 3V8 Buck Boost Converter; Height: 0.35mm; ComponentLink1Description: DataSheet; ComponentLink1URL: https://eu.mouser.com/datasheet/2/427/dcrcwe3-1762152.pdf; ComponentLink2Description: Mouser; ComponentLink2URL: https://eu.mouser.com/ProductDetail/Vishay-Dale/CRCW040291K0FKED?qs=Po1ctqG%2F82oNfd9H7rZeFQ%3D%3D; Supplier 1: Future Electronics; Supplier 2: Arrow; Supplier 3: Farnell; Supplier 4: Newark; Supplier 5: Digi-Key; Supplier Part Number 1: CRCW040291K0FKED-REEL; Supplier Part Number 2: CRCW040291K0FKED; Supplier Part Number 3: 2121853; Supplier Part Number 4: 24W2519; Supplier Part Number 5: 541-91.0KLCT-ND; Mouser Part Number: 71-CRCW040291K0FKED
U22 = IC - TPS63802DLAT: as U21 on sheet 3V8 Buck Boost Converter; ComponentLink1Description: DataSheet; ComponentLink1URL: https://www.ti.com/lit/ds/symlink/tps63802.pdf?ts=1611132560608&ref_url=https%253A%252F%252Fwww.google.com%252F; ComponentLink2Description: Mouser; ComponentLink2URL: https://www.mouser.com.tr/ProductDetail/Maxim-Integrated/MAX17055ETB%2bT?qs=sGAEpiMZZMve4%2FbfQkoj%252BAs6FTSsQJaJrD7Z3v0Qe9M%3D; Minimum Operating Temperature: -40; Maximum Operating Temperature: +125; Supplier 1: Avnet; Supplier 2: Mouser; Supplier 3: Digi-Key; Supplier Part Number 1: TPS63802DLAT; Supplier Part Number 2: 595-TPS63802DLAT; Supplier Part Number 3: 296-TPS63802DLATCT-ND; Case: VSON-10; ComponentLink3Description: Product Page; ComponentLink3URL: https://www.ti.com/store/ti/en/p/product/?p=TPS63802DLAT; Mouser Part Number: 595-TPS63802DLAT

## Sheet GSM Power.SchDoc: GSM Power Switch and Filter
size A4; ApprovedBy: Mehmet Günce Akkoyun; CheckedBy: Mehmet Günce Akkoyun; Author: Mehmet Günce Akkoyun; CompanyName: Ovoo Electronics; DrawnBy: Mehmet Günce Akkoyun; Engineer: Mehmet Günce Akkoyun; Organization: Ovoo Electronics; Address1: Necip Fazıl Mah. Ortaırmak Sok.; Address2: Birgül Apt. No: 19/6; Address3: Meram / Konya; Address4: Turkiye; DocumentNumber: 4; Revision: R06; SheetNumber: 4; SheetTotal: 54
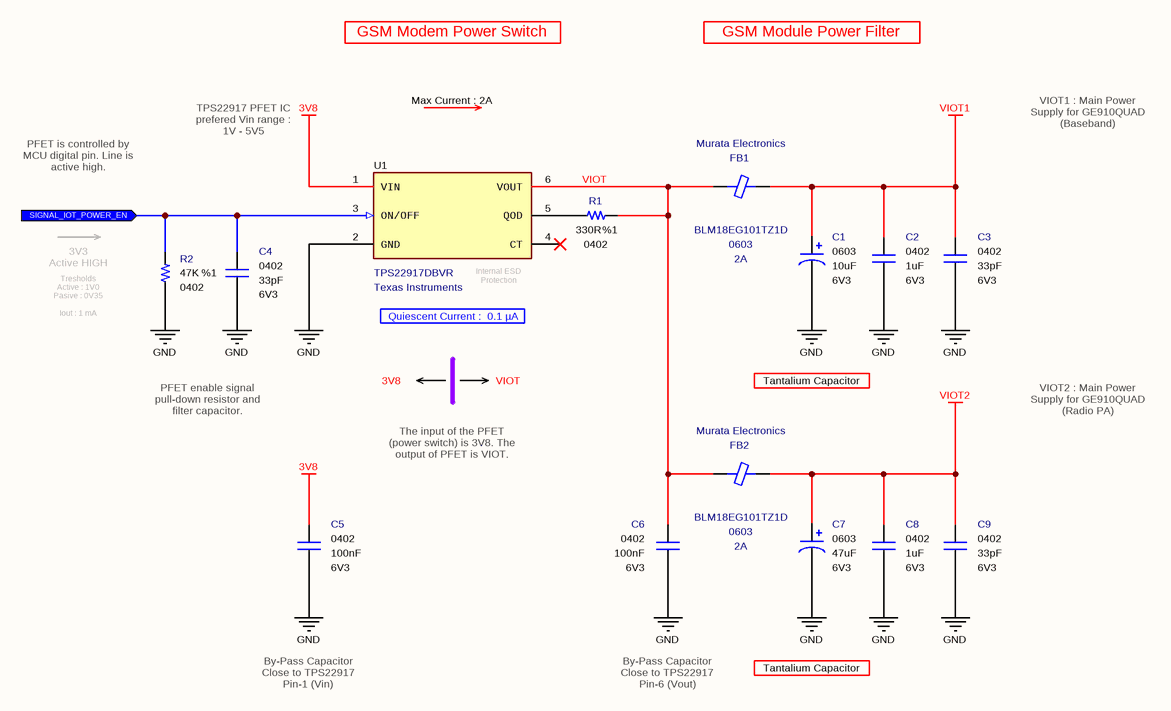
[diagram p4: GSM Power.SchDoc]

### Parts
C1  value 10uF  Case: 0603  Voltage: 6V3  [CAPACITOR_0603 - TANTALUM]  (hidden comment: Tantalum Capacitor)
C2  value 1uF  Case: 0402  Voltage: 6V3  [CAPACITOR_0402]  (hidden comment: Multilayer Ceramic Capacitor)
C3  value 33pF  Case: 0402  Voltage: 6V3  [CAPACITOR_0402]  (hidden comment: Multilayer Ceramic Capacitor)
C4  value 33pF  Case: 0402  Voltage: 6V3  [CAPACITOR_0402]  (hidden comment: Multilayer Ceramic Capacitor)
C5  value 100nF  Case: 0402  Voltage: 6V3  [CAPACITOR_0402]  (hidden comment: Multilayer Ceramic Capacitor)
C6  value 100nF  Case: 0402  Voltage: 6V3  [CAPACITOR_0402]  (hidden comment: Multilayer Ceramic Capacitor)
C7  value 47uF  Case: 0603  Voltage: 6V3  [CAPACITOR_0603 - TANTALUM]  (hidden comment: Tantalum Capacitor)
C8  value 1uF  Case: 0402  Voltage: 6V3  [CAPACITOR_0402]  (hidden comment: Multilayer Ceramic Capacitor)
C9  value 33pF  Case: 0402  Voltage: 6V3  [CAPACITOR_0402]  (hidden comment: Multilayer Ceramic Capacitor)
FB1  value BLM18EG101TZ1D  Case: 0603  Maximum DC Current: 2A  Manufacturer Name: Murata Electronics  [INDUCATOR_0603]  (hidden comment: Ferrite Bead)
FB2  value BLM18EG101TZ1D  Case: 0603  Maximum DC Current: 2A  Manufacturer Name: Murata Electronics  [INDUCATOR_0603]  (hidden comment: Ferrite Bead)
R1  value 330R  Tolerance: %1  Case: 0402  [RESISTOR_0402]  (hidden comment: 330R - 0402 - %1 - 1/16W)
R2  value 47K  Tolerance: %1  Case: 0402  [RESISTOR_0402]  (hidden comment: 47K - 0402 - %1 - 1/16W)
U1  Manufacturer Part Number: TPS22917DBVR  Manufacturer Name: Texas Instruments  [SOT-23-6]  (hidden comment: Power Switch)

### Ports
SIGNAL_IOT_POWER_EN (in)

### Nets
3V8: C5.1 U1.1(VIN)
GND: C1.2 C2.1 C3.1 C4.1 C5.2 C6.2 C7.2 C8.1 C9.1 R2.1 U1.2(GND)
VIOT1: C1.1 C2.2 C3.2 FB1.2
VIOT2: C7.1 C8.2 C9.2 FB2.2
SIGNAL_IOT_3V3.SIGNAL_IOT_POWER_EN: C4.2 R2.2 U1.3(ON/OFF) ; port SIGNAL_IOT_POWER_EN
VIOT: C6.1 FB1.1 FB2.1 R1.1 U1.6(VOUT)
NetR1_2: R1.2 U1.5(QOD)

Not connected (* = marked no-connect by the designer): U1 4(CT)*

### Notes on the sheet
- GSM Modem Power Switch
- GSM Module Power Filter
- TPS22917 PFET IC prefered Vin range : 1V - 5V5
- Max Current : 2A
- VIOT1 : Main Power Supply for GE910QUAD (Baseband)
- PFET is controlled by MCU digital pin. Line is active high.
- (near R2) 3V3
  Active HIGH
- (near U1) Internal ESD Protection
- (near R2) Tresholds
  Active : 1V0
  Pasive : 0V35
  Iout : 1 mA
- Quiescent Current :  0.1 µA
- PFET enable signal pull-down resistor and filter capacitor.
- 3V8
- VIOT
- Tantalium Capacitor
- VIOT2 : Main Power Supply for GE910QUAD (Radio PA)
- The input of the PFET (power switch) is 3V8. The output of PFET is VIOT.
- By-Pass Capacitor
  Close to TPS22917
  Pin-1 (Vin)
- By-Pass Capacitor
  Close to TPS22917
  Pin-6 (Vout)
- Engineer
- All Rights are reserved to Customer and Engineer. [2021]
- Size:
- Date:
- A4
- Project :
- Time:
- Sheet
- of
- Customer
- Product ID
- Module ID
- Version
- File:
- Revision

### Library data of the parts
C1 = Capacitor - 10uF [0603-6V3] (Tantalium): Capacitor - 10uF [0603] (Tantalium); Manufacturer Name: AVX; Manufacturer Part Number: F380J106MMAAH3; ESR: 200 mOhms; Leakage Current: 10uA; Tolerance: 20%; Height: 0.8mm; Maximum Operating Temperature: +105; Minimum Operating Temperature: -55; ROHS: Yes; ComponentLink1Description: DataSheet; ComponentLink1URL: https://www.mouser.com.tr/datasheet/2/40/f38-775706.pdf; ComponentLink2Description: Mouser; ComponentLink2URL: https://www.mouser.com.tr/ProductDetail/AVX/F380J106MMAAH3?qs=sGAEpiMZZMtZ1n0r9vR22fixilZl6Mr8zRKleESmvcDFwZ4LSyC6Pg%3D%3D; Supplier 1: Mouser; Supplier 2: Digi-Key; Supplier Part Number 2: 478-12031-1-ND; Supplier Part Number 1: 581-F380J106MMAAH3; Mouser Part Number: 581-F380J106MMAAH3
C2 C8 = Capacitor - 1uF [0402-6V3]: Capacitor - 1uF [0402] (Ceramic); Manufacturer Name: Murata Electronics; Manufacturer Part Number: GRM153R60J105ME95D; Dielectric: X5R; Tolerance: 20%; Height: 0.3mm; Maximum Operating Temperature: +85; Minimum Operating Temperature: -55; RoHS: Yes; Weight: 6mg; ComponentLink1Description: DataSheet; ComponentLink1URL: https://psearch.en.murata.com/capacitor/product/GRM153R60J105ME95%23.html; ComponentLink2Description: Mouser; ComponentLink2URL: https://www.mouser.com/Search/Refine.aspx?Keyword=81-GRM153R60J105ME5D; Supplier 1: Future Electronics; Supplier 2: Future Electronics; Supplier 3: Mouser; Supplier 4: Arrow; Supplier 5: Digi-Key; Supplier Part Number 5: 490-14576-1-ND; Supplier Part Number 4: GRM153R60J105ME95D; Supplier Part Number 3: 81-GRM153R60J105ME5D; Supplier Part Number 2: GRM153R60J105ME95D-REEL; Supplier Part Number 1: GRM153R60J105ME95D-CUTT; Mouser Part Number: 81-GRM153R60J105ME5D
C3 C4 C9 = Capacitor - 33pF [0402-6V3]: as C222 on sheet 3V8 Buck Boost Converter; Height: 0.5mm; Maximum Operating Temperature: +125; Minimum Operating Temperature: -55; ROHS: Yes; ComponentLink1Description: DataSheet; ComponentLink1URL: https://api.kemet.com/component-edge/download/datasheet/C0402C330J9RACAUTO.pdf; ComponentLink2Description: Mouser; ComponentLink2URL: https://www.mouser.com/Search/Refine.aspx?Keyword=80-C0402C330J9RAUTO; Supplier 1: Mouser; Supplier Part Number 1: 80-C0402C330J9RAUTO; Mouser Part Number: 80-C0402C330J9RAUTO
C5 C6 = Capacitor - 100nF [0402-6V3]: as C223 on sheet 3V8 Buck Boost Converter; Height: 0.25mm; ComponentLink1Description: Mouser; ComponentLink1URL: https://www.mouser.com.tr/ProductDetail/AVX/04026D104KAT4A?qs=sGAEpiMZZMs0AnBnWHyRQPg4iYkCw7IMED%2F4kpqgf7w%3D; ComponentLink2Description: DataSheet; ComponentLink2URL: https://www.mouser.com.tr/datasheet/2/40/cx5r-776519.pdf; ROHS: Yes; Maximum Operating Temperature: +85; Minimum Operating Temperature: -55; Supplier 1: Avnet; Supplier Part Number 1: 04026D104KAT4A; Mouser Part Number: 581-04026D104KAT4A
C7 = Capacitor - 47u [0603-6V3] (Tantalium): Capacitor - 47uF [0603] (Tantalium); Manufacturer Name: AVX; Manufacturer Part Number: F380J476MMAAXEH3; ESR: 300 mOhms; Leakage Current: 59.2uA; Tolerance: 20%; Height: 0.8 mm; Maximum Operating Temperature: +105; Minimum Operating Temperature: -55; ROHS: Yes; Weight: 2mg; ComponentLink1Description: DataSheet; ComponentLink1URL: https://www.mouser.com.tr/datasheet/2/40/f38-775706.pdf; ComponentLink2Description: Mouser; ComponentLink2URL: https://www.mouser.com.tr/ProductDetail/AVX/F380J476MMAAXEH3?qs=sGAEpiMZZMtZ1n0r9vR22RxGXmrWTp1dAwL15%252BtiGosce1Uk5KTrYw%3D%3D; Supplier 1: Avnet; Supplier Part Number 1: F380J476MMAAXEH3; Mouser Part Number: 581-F380J476MMAAXEH3
FB1 FB2 = Ferrite Bead - 2A [0603]: Ferrite Beads 0603 100ohms 2000mA Auto Infotainment; Tolerance: 25%; Maximum DC Resistance: 45 mOhms; Height: 0.75mm; ROHS: Yes; Minimum Operating Temperature: -55; Maximum Operating Temperature: +125; Impedance: 100 Ohms; ComponentLink1Description: DataSheet; ComponentLink1URL: http://www.murata.com/~/media/webrenewal/support/library/catalog/products/emc/emifil/c31e.ashx?la=en-gb; ComponentLink2Description: Mouser; ComponentLink2URL: https://www.mouser.com/Search/Refine.aspx?Keyword=81-BLM18EG101TZ1D; Supplier 1: Mouser; Supplier Part Number 1: 81-BLM18EG101TZ1D; Manufacturer Part Number: BLM18EG101TZ1D; Mouser Part Number: 81-BLM18EG101TZ1D; Mouser Price/Stock: https://www.mouser.com/Search/Refine.aspx?Keyword=81-BLM18EG101TZ1D
R1 = Resistor - 330R: Thick Film Resistors - SMD 1/16 W 330 Ohm 1%; Manufacturer Name: Vishay; Manufacturer Part Number: CRCW0402330RFKED; Height: 0.4mm; ComponentLink1Description: DataSheet; ComponentLink1URL: https://www.mouser.com.tr/datasheet/2/427/dcrcwe3-1762152.pdf; ComponentLink2Description: Mouser; ComponentLink2URL: https://www.mouser.com.tr/ProductDetail/Vishay-Dale/CRCW0402330RFKED?qs=sGAEpiMZZMu61qfTUdNhG2DpbjADlD3GGS6SwBlLi5Q%3D; Supplier 1: Digi-Key; Supplier 2: Digi-Key; Supplier Part Number 2: 541-330LDKR-ND; Supplier Part Number 1: 541-330LCT-ND; Mouser Part Number: 71-CRCW0402-330-E3; Supplier 3: Digi-Key; Supplier 4: Newark; Supplier 5: Newark; Supplier 6: RSComponents; Supplier 7: RSComponents; Supplier 8: Future Electronics; Supplier 9: Future Electronics; Supplier 10: Newark; Supplier 11: Newark; Supplier 12: Arrow Electronics; Supplier 13: Mouser; Supplier 14: Avnet; Supplier 15: Farnell; Supplier 16: Farnell; Supplier 17: Farnell; Supplier 18: Allied Electronics; Supplier 19: Allied Electronics; Supplier 20: Avnet; Supplier 21: Avnet; Supplier 22: Future Electronics; Supplier 23: Future Electronics; Supplier 24: Newark; Supplier 25: RSComponents; Supplier 26: RSComponents; Supplier Part Number 3: 541-330LTR-ND; Supplier Part Number 4: 52K6981; Supplier Part Number 5: 61M5301; Supplier Part Number 6: 6789178P; Supplier Part Number 7: 6789178; Supplier Part Number 9: 9848185; Supplier Part Number 8: 4103726; Supplier Part Number 10: 25AC7117; Supplier Part Number 11: 42K3473; Supplier Part Number 26: 1819488; Supplier Part Number 25: 1688408; Supplier Part Number 24: 24W2220; Supplier Part Number 23: CRCW0402330RFKED-REEL; Supplier Part Number 22: CRCW0402330RFKED-CUTT; Supplier Part Number 21: 52K6981; Supplier Part Number 20: 42K3473; Supplier Part Number 19: 70272759; Supplier Part Number 18: 70202255; Supplier Part Number 17: 1469709RL; Supplier Part Number 16: 2121540; Supplier Part Number 15: 1469709; Supplier Part Number 14: CRCW0402330RFKED; Supplier Part Number 13: 71-CRCW0402-330-E3; Supplier Part Number 12: CRCW0402330RFKED
R2 = Resistor - 47K: as R69 on sheet 5V Buck Boost Converter; Height: 0.4mm; ComponentLink1Description: DataSheet; ComponentLink1URL: https://www.mouser.com.tr/datasheet/2/427/dcrcwe3-1762152.pdf; ComponentLink2Description: Mouser; ComponentLink2URL: https://www.mouser.com.tr/ProductDetail/Vishay-Dale/CRCW040247K0FKED?qs=sGAEpiMZZMu61qfTUdNhG2DpbjADlD3GL%252B3h1elTxqU%3D; Supplier 1: RSComponents; Supplier 2: Newark; Supplier Part Number 1: 6789361P; Supplier Part Number 2: 52K7097; Supplier 3: Avnet; Supplier 4: RSComponents; Supplier 5: Future Electronics; Supplier 6: Future Electronics; Supplier 7: Newark; Supplier 8: Arrow Electronics; Supplier 9: Mouser; Supplier 10: Newark; Supplier 11: Avnet; Supplier 12: Digi-Key; Supplier 13: Digi-Key; Supplier 14: Digi-Key; Supplier 15: Newark; Supplier 16: Farnell; Supplier 17: Farnell; Supplier 18: Farnell; Supplier 19: Allied Electronics; Supplier 20: Allied Electronics; Supplier 21: Avnet; Supplier 22: Future Electronics; Supplier 23: Future Electronics; Supplier 24: Future Electronics; Supplier 25: Newark; Supplier 26: RSComponents; Supplier 27: RSComponents; Supplier Part Number 3: 52K7097; Supplier Part Number 4: 6789361; Supplier Part Number 5: 2103738; Supplier Part Number 6: 7521222; Supplier Part Number 7: 42K3500; Supplier Part Number 8: CRCW040247K0FKED; Supplier Part Number 12: 541-47.0KLCT-ND; Supplier Part Number 14: 541-47.0KLTR-ND; Supplier Part Number 10: 61M5310; Supplier Part Number 9: 71-CRCW0402-47K-E3; Supplier Part Number 13: 541-47.0KLDKR-ND; Supplier Part Number 11: CRCW040247K0FKED; Supplier Part Number 15: 25AC7165; Supplier Part Number 16: 1469719; Supplier Part Number 18: 2121814; Supplier Part Number 17: 1469719RL; Supplier Part Number 19: 70202660; Supplier Part Number 20: 70272767; Supplier Part Number 21: 42K3500; Supplier Part Number 22: 6128776; Supplier Part Number 24: CRCW040247K0FKED-REEL; Supplier Part Number 23: CRCW040247K0FKED-CUTT; Supplier Part Number 25: 24W2315; Supplier Part Number 26: 1688455; Supplier Part Number 27: 1823505
U1 = IC - TPS22917DBVR: Power Switch MosFet; Height: 1.45mm; ComponentLink1Description: DataSheet; ComponentLink1URL: http://www.ti.com/lit/gpn/tps22917; ComponentLink2Description: Mouser; ComponentLink2URL: https://www.mouser.com/Search/Refine.aspx?Keyword=595-TPS22917DBVR; Supplier 1: Mouser; Supplier 2: Digi-Key; Supplier Part Number 1: 595-TPS22917DBVR; Supplier Part Number 2: 296-50498-1-ND; Mouser Part Number: 595-TPS22917DBVR; Case: SOT-23-6

## Sheet Main Power Switch.SchDoc: Main Power Switch
size A4; ApprovedBy: Mehmet Günce Akkoyun; CheckedBy: Mehmet Günce Akkoyun; Author: Mehmet Günce Akkoyun; CompanyName: Ovoo Electronics; DrawnBy: Mehmet Günce Akkoyun; Engineer: Mehmet Günce Akkoyun; Organization: Ovoo Electronics; Address1: Necip Fazıl Mah. Ortaırmak Sok.; Address2: Birgül Apt. No: 19/6; Address3: Meram / Konya; Address4: Turkiye; DocumentNumber: 6; Revision: R06; SheetNumber: 6; SheetTotal: 54
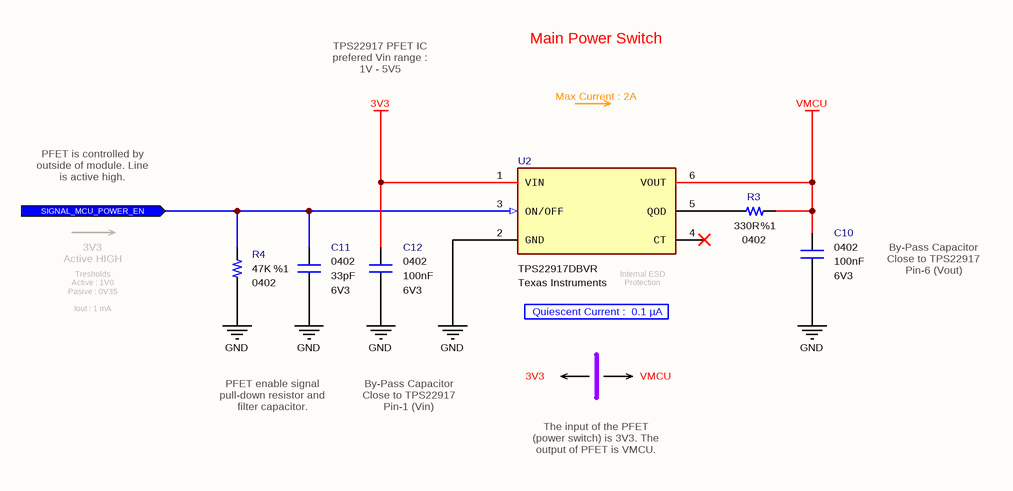
[diagram p5: Main Power Switch.SchDoc]

### Parts
C10  value 100nF  Case: 0402  Voltage: 6V3  [CAPACITOR_0402]  (hidden comment: Multilayer Ceramic Capacitor)
C11  value 33pF  Case: 0402  Voltage: 6V3  [CAPACITOR_0402]  (hidden comment: Multilayer Ceramic Capacitor)
C12  value 100nF  Case: 0402  Voltage: 6V3  [CAPACITOR_0402]  (hidden comment: Multilayer Ceramic Capacitor)
R3  value 330R  Tolerance: %1  Case: 0402  [RESISTOR_0402]  (hidden comment: 330R - 0402 - %1 - 1/16W)
R4  value 47K  Tolerance: %1  Case: 0402  [RESISTOR_0402]  (hidden comment: 47K - 0402 - %1 - 1/16W)
U2  Manufacturer Part Number: TPS22917DBVR  Manufacturer Name: Texas Instruments  [SOT-23-6]  (hidden comment: Power Switch)

### Ports
SIGNAL_MCU_POWER_EN (in)

### Nets
3V3: C12.1 U2.1(VIN)
GND: C10.2 C11.1 C12.2 R4.1 U2.2(GND)
VMCU: C10.1 R3.1 U2.6(VOUT)
SIGNAL_MCU_POWER_EN: C11.2 R4.2 U2.3(ON/OFF) ; port SIGNAL_MCU_POWER_EN
NetR3_2: R3.2 U2.5(QOD)

Not connected (* = marked no-connect by the designer): U2 4(CT)*

### Notes on the sheet
- Main Power Switch
- TPS22917 PFET IC prefered Vin range : 1V - 5V5
- Max Current : 2A
- PFET is controlled by outside of module. Line is active high.
- 3V3
  Active HIGH
- (near U2) Internal ESD Protection
- By-Pass Capacitor
  Close to TPS22917
  Pin-6 (Vout)
- Tresholds
  Active : 1V0
  Pasive : 0V35
  Iout : 1 mA
- Quiescent Current :  0.1 µA
- PFET enable signal pull-down resistor and filter capacitor.
- By-Pass Capacitor
  Close to TPS22917
  Pin-1 (Vin)
- 3V3
- VMCU
- The input of the PFET (power switch) is 3V3. The output of PFET is VMCU.
- Engineer
- All Rights are reserved to Customer and Engineer. [2021]
- Size:
- Date:
- A4
- Project :
- Time:
- Sheet
- of
- Customer
- Product ID
- Module ID
- Version
- File:
- Revision

### Library data of the parts
C10 C12 = Capacitor - 100nF [0402-6V3]: as C223 on sheet 3V8 Buck Boost Converter; Height: 0.25mm; ComponentLink1Description: Mouser; ComponentLink1URL: https://www.mouser.com.tr/ProductDetail/AVX/04026D104KAT4A?qs=sGAEpiMZZMs0AnBnWHyRQPg4iYkCw7IMED%2F4kpqgf7w%3D; ComponentLink2Description: DataSheet; ComponentLink2URL: https://www.mouser.com.tr/datasheet/2/40/cx5r-776519.pdf; ROHS: Yes; Maximum Operating Temperature: +85; Minimum Operating Temperature: -55; Supplier 1: Avnet; Supplier Part Number 1: 04026D104KAT4A; Mouser Part Number: 581-04026D104KAT4A
C11 = Capacitor - 33pF [0402-6V3]: as C222 on sheet 3V8 Buck Boost Converter; Height: 0.5mm; Maximum Operating Temperature: +125; Minimum Operating Temperature: -55; ROHS: Yes; ComponentLink1Description: DataSheet; ComponentLink1URL: https://api.kemet.com/component-edge/download/datasheet/C0402C330J9RACAUTO.pdf; ComponentLink2Description: Mouser; ComponentLink2URL: https://www.mouser.com/Search/Refine.aspx?Keyword=80-C0402C330J9RAUTO; Supplier 1: Mouser; Supplier Part Number 1: 80-C0402C330J9RAUTO; Mouser Part Number: 80-C0402C330J9RAUTO
R3 = Resistor - 330R: as R1 on sheet GSM Power; Height: 0.4mm; ComponentLink1Description: DataSheet; ComponentLink1URL: https://www.mouser.com.tr/datasheet/2/427/dcrcwe3-1762152.pdf; ComponentLink2Description: Mouser; ComponentLink2URL: https://www.mouser.com.tr/ProductDetail/Vishay-Dale/CRCW0402330RFKED?qs=sGAEpiMZZMu61qfTUdNhG2DpbjADlD3GGS6SwBlLi5Q%3D; Supplier 1: Digi-Key; Supplier 2: Digi-Key; Supplier Part Number 2: 541-330LDKR-ND; Supplier Part Number 1: 541-330LCT-ND; Mouser Part Number: 71-CRCW0402-330-E3; Supplier 3: Digi-Key; Supplier 4: Newark; Supplier 5: Newark; Supplier 6: RSComponents; Supplier 7: RSComponents; Supplier 8: Future Electronics; Supplier 9: Future Electronics; Supplier 10: Newark; Supplier 11: Newark; Supplier 12: Arrow Electronics; Supplier 13: Mouser; Supplier 14: Avnet; Supplier 15: Farnell; Supplier 16: Farnell; Supplier 17: Farnell; Supplier 18: Allied Electronics; Supplier 19: Allied Electronics; Supplier 20: Avnet; Supplier 21: Avnet; Supplier 22: Future Electronics; Supplier 23: Future Electronics; Supplier 24: Newark; Supplier 25: RSComponents; Supplier 26: RSComponents; Supplier Part Number 3: 541-330LTR-ND; Supplier Part Number 4: 52K6981; Supplier Part Number 5: 61M5301; Supplier Part Number 6: 6789178P; Supplier Part Number 7: 6789178; Supplier Part Number 9: 9848185; Supplier Part Number 8: 4103726; Supplier Part Number 10: 25AC7117; Supplier Part Number 11: 42K3473; Supplier Part Number 26: 1819488; Supplier Part Number 25: 1688408; Supplier Part Number 24: 24W2220; Supplier Part Number 23: CRCW0402330RFKED-REEL; Supplier Part Number 22: CRCW0402330RFKED-CUTT; Supplier Part Number 21: 52K6981; Supplier Part Number 20: 42K3473; Supplier Part Number 19: 70272759; Supplier Part Number 18: 70202255; Supplier Part Number 17: 1469709RL; Supplier Part Number 16: 2121540; Supplier Part Number 15: 1469709; Supplier Part Number 14: CRCW0402330RFKED; Supplier Part Number 13: 71-CRCW0402-330-E3; Supplier Part Number 12: CRCW0402330RFKED
R4 = Resistor - 47K: as R69 on sheet 5V Buck Boost Converter; Height: 0.4mm; ComponentLink1Description: DataSheet; ComponentLink1URL: https://www.mouser.com.tr/datasheet/2/427/dcrcwe3-1762152.pdf; ComponentLink2Description: Mouser; ComponentLink2URL: https://www.mouser.com.tr/ProductDetail/Vishay-Dale/CRCW040247K0FKED?qs=sGAEpiMZZMu61qfTUdNhG2DpbjADlD3GL%252B3h1elTxqU%3D; Supplier 1: RSComponents; Supplier 2: Newark; Supplier Part Number 1: 6789361P; Supplier Part Number 2: 52K7097; Supplier 3: Avnet; Supplier 4: RSComponents; Supplier 5: Future Electronics; Supplier 6: Future Electronics; Supplier 7: Newark; Supplier 8: Arrow Electronics; Supplier 9: Mouser; Supplier 10: Newark; Supplier 11: Avnet; Supplier 12: Digi-Key; Supplier 13: Digi-Key; Supplier 14: Digi-Key; Supplier 15: Newark; Supplier 16: Farnell; Supplier 17: Farnell; Supplier 18: Farnell; Supplier 19: Allied Electronics; Supplier 20: Allied Electronics; Supplier 21: Avnet; Supplier 22: Future Electronics; Supplier 23: Future Electronics; Supplier 24: Future Electronics; Supplier 25: Newark; Supplier 26: RSComponents; Supplier 27: RSComponents; Supplier Part Number 3: 52K7097; Supplier Part Number 4: 6789361; Supplier Part Number 5: 2103738; Supplier Part Number 6: 7521222; Supplier Part Number 7: 42K3500; Supplier Part Number 8: CRCW040247K0FKED; Supplier Part Number 12: 541-47.0KLCT-ND; Supplier Part Number 14: 541-47.0KLTR-ND; Supplier Part Number 10: 61M5310; Supplier Part Number 9: 71-CRCW0402-47K-E3; Supplier Part Number 13: 541-47.0KLDKR-ND; Supplier Part Number 11: CRCW040247K0FKED; Supplier Part Number 15: 25AC7165; Supplier Part Number 16: 1469719; Supplier Part Number 18: 2121814; Supplier Part Number 17: 1469719RL; Supplier Part Number 19: 70202660; Supplier Part Number 20: 70272767; Supplier Part Number 21: 42K3500; Supplier Part Number 22: 6128776; Supplier Part Number 24: CRCW040247K0FKED-REEL; Supplier Part Number 23: CRCW040247K0FKED-CUTT; Supplier Part Number 25: 24W2315; Supplier Part Number 26: 1688455; Supplier Part Number 27: 1823505
U2 = IC - TPS22917DBVR: Power Switch MosFet; Height: 1.45mm; ComponentLink1Description: DataSheet; ComponentLink1URL: http://www.ti.com/lit/gpn/tps22917; ComponentLink2Description: Mouser; ComponentLink2URL: https://www.mouser.com/Search/Refine.aspx?Keyword=595-TPS22917DBVR; Supplier 1: Mouser; Supplier 2: Digi-Key; Supplier Part Number 1: 595-TPS22917DBVR; Supplier Part Number 2: 296-50498-1-ND; Mouser Part Number: 595-TPS22917DBVR; Case: SOT-23-6